# Altium schematic sheet ColourBreakout.SchDoc: Colour Sensor Breakout
size A4; Engineer: Jouveer Naidoo; SheetNumber: 1; SheetTotal: 1; ProjectIdentifier: Spin Up
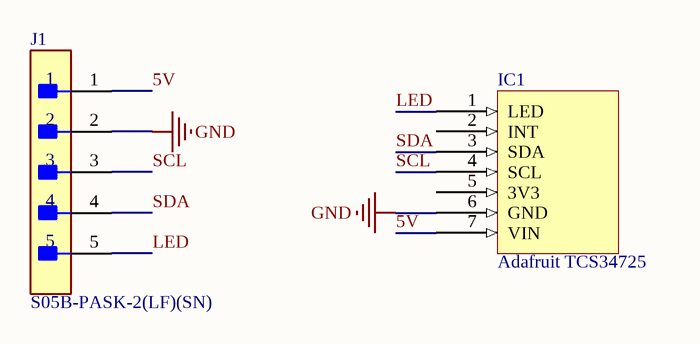
[diagram p0: ColourBreakout.SchDoc]

## Parts
IC1  Adafruit TCS34725  [Adafruit TCS34725-Footprint-1]
J1  S05B-PASK-2(LF)(SN)  [FP-S05B-PASK-2_LF_SN-MFG]

## Nets
GND: IC1.6(GND) J1.2
5V: IC1.7(VIN) J1.1
LED: IC1.1(LED) J1.5
SCL: IC1.4(SCL) J1.3
SDA: IC1.3(SDA) J1.4

Not connected (* = marked no-connect by the designer): IC1 2(INT) 5(3V3)

## Notes on the sheet
- Size:
- Date:
- Title
- A4
- Project:
- Time:
- Revision:
- Sheet
- of
- Engineer
- File:

## Library data of the parts
IC1 = CMP-001-0002-1
J1 = CMP-17439-000393-1: CONN HEADER R/A 5POS 2MM; Current Rating: 3A; Voltage Rating: 250V; Number of Contacts: 5; System: Connector; Contact Shape: Square; Orientation: Right Angle; Mount: Through Hole; Fastening Type: Ramp; Contact Material: Copper Alloy; Insulation Material: PBT; Insulation Color: Natural; Contact Type: Male Pin; Flammability Rating: UL94 V-0; Contact Plating: Tin; Connector Type: Header; Number of Positions: 5; Contact Finish - Mating: TIN; Housing Color: White; Color: Natural; Termination: Solder; Series: PA; Lead Free: Lead Free; Pitch: 2mm; Number of Rows: 1; Package Quantity: 500; Packaging: Bulk